# EAGLE schematic boron-v1.00 (EAGLE 9.1.0)
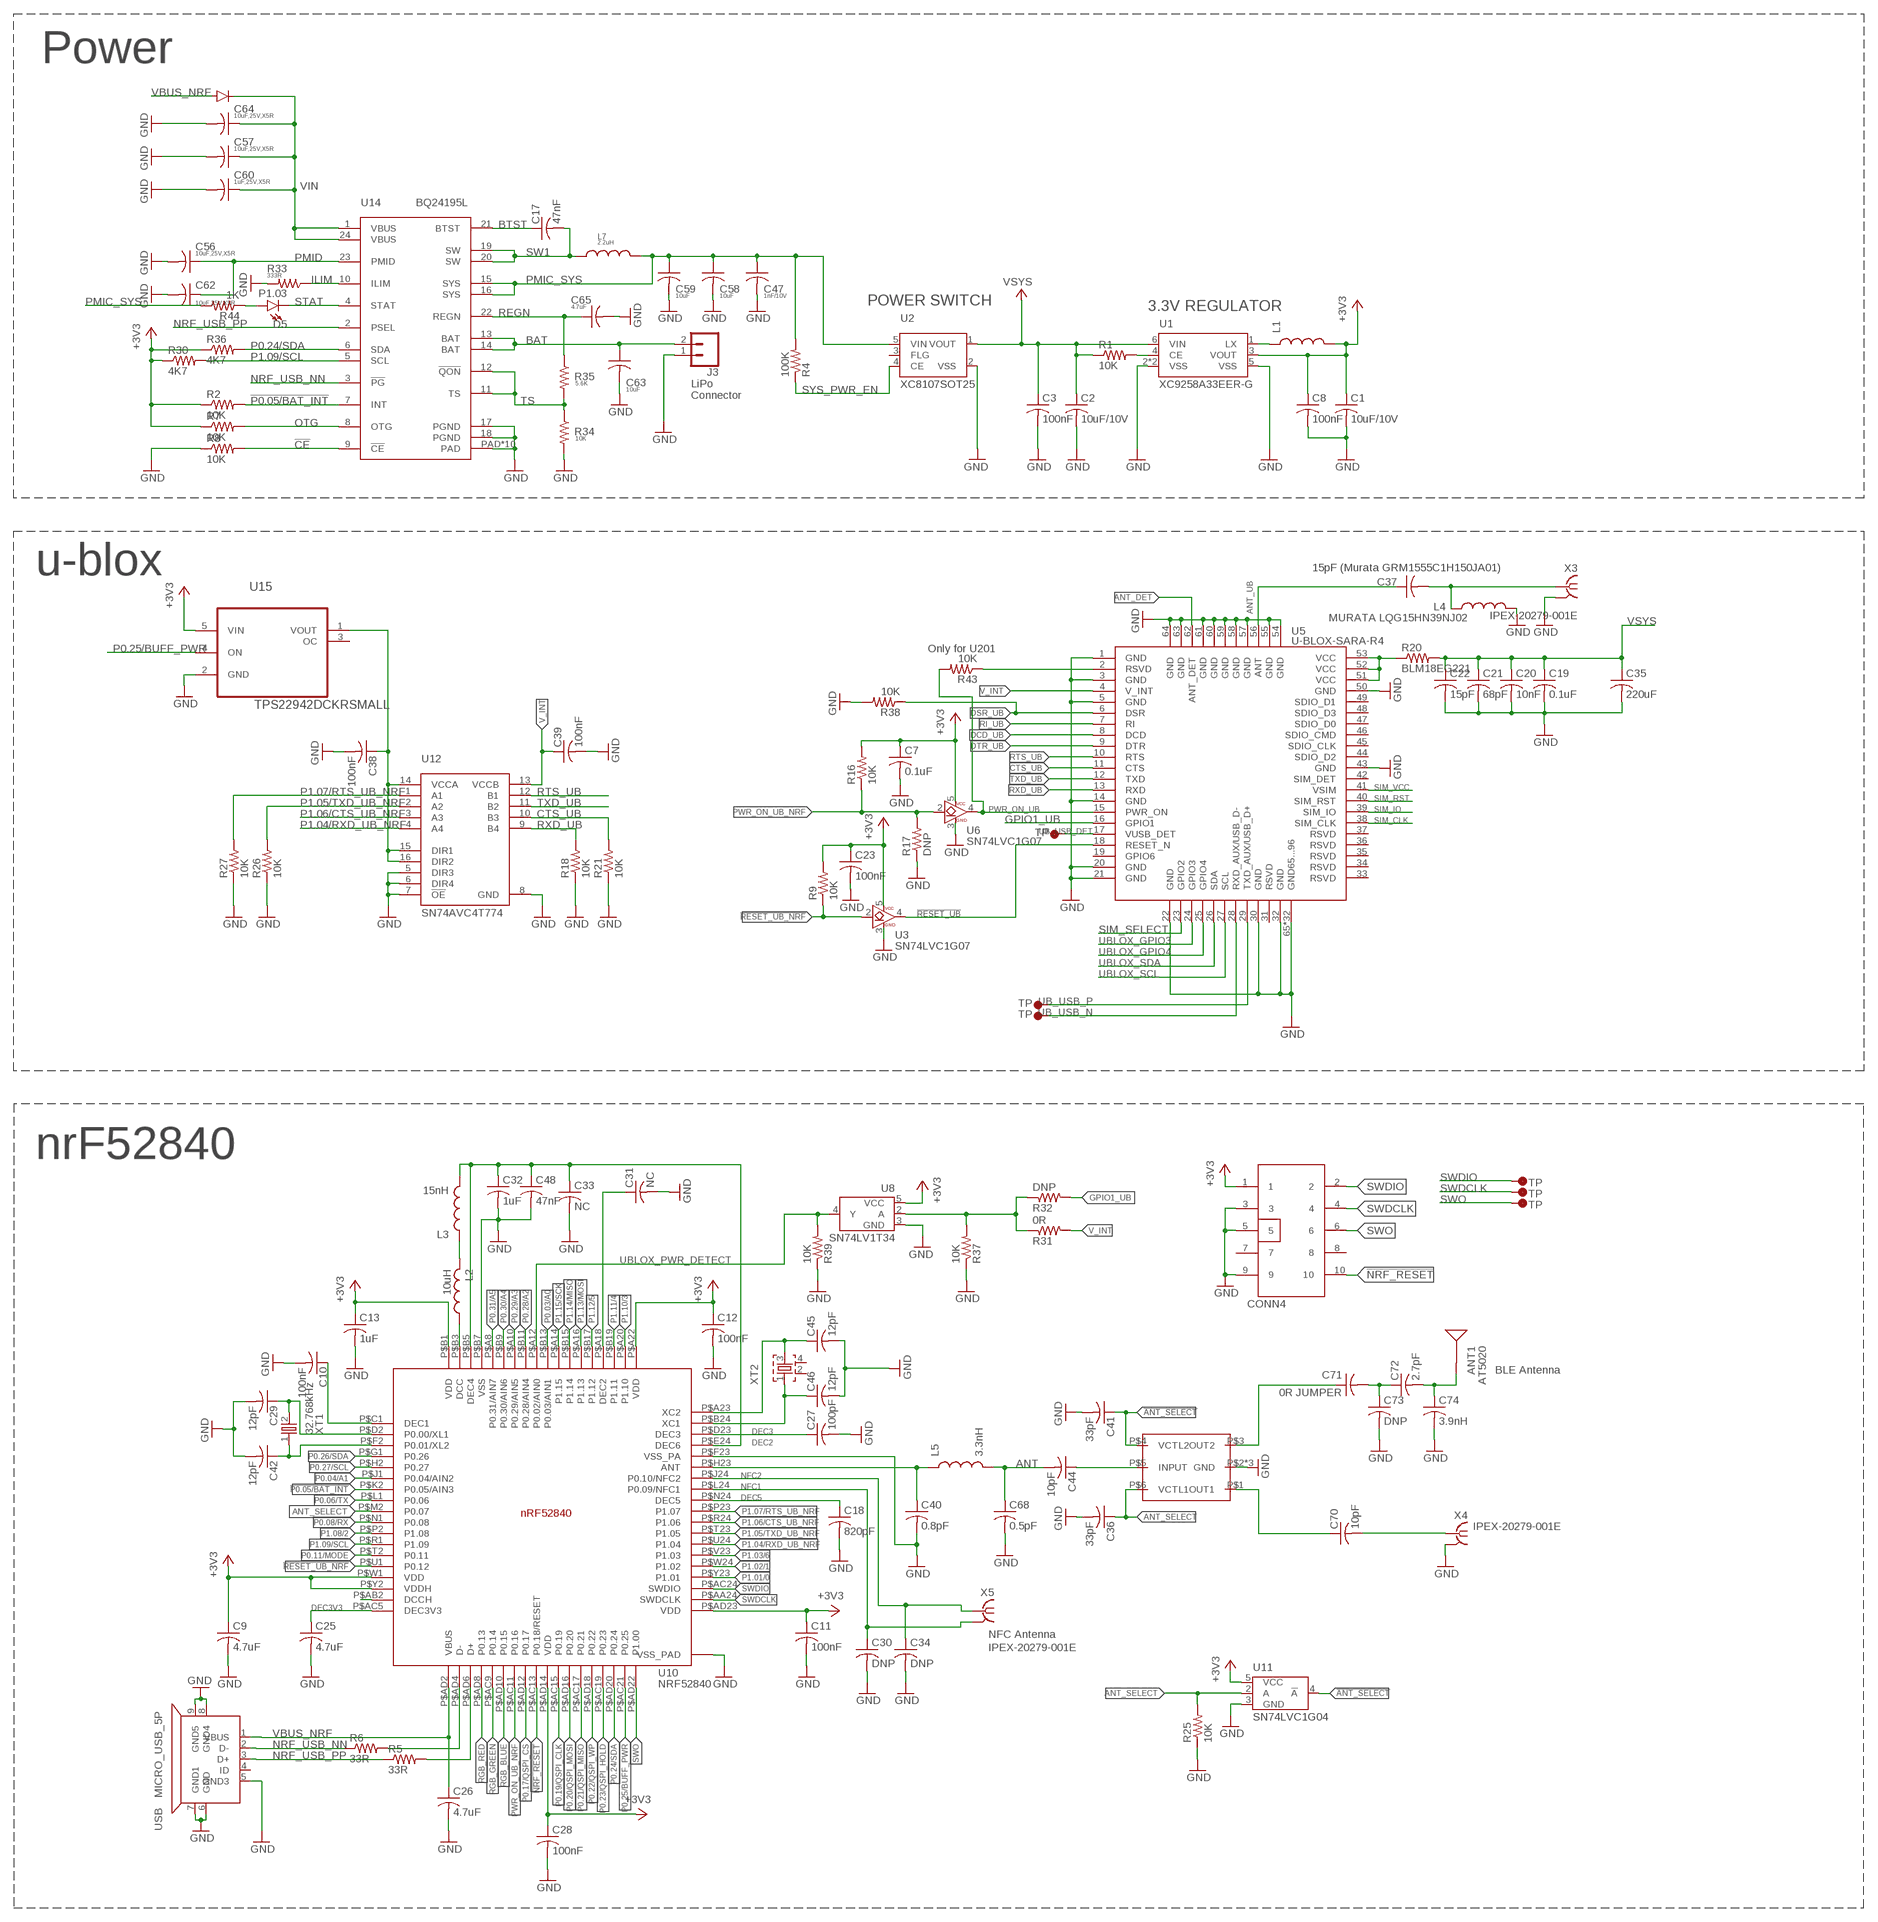
[diagram p0: schematic, sheet 1, part 1 of 2]
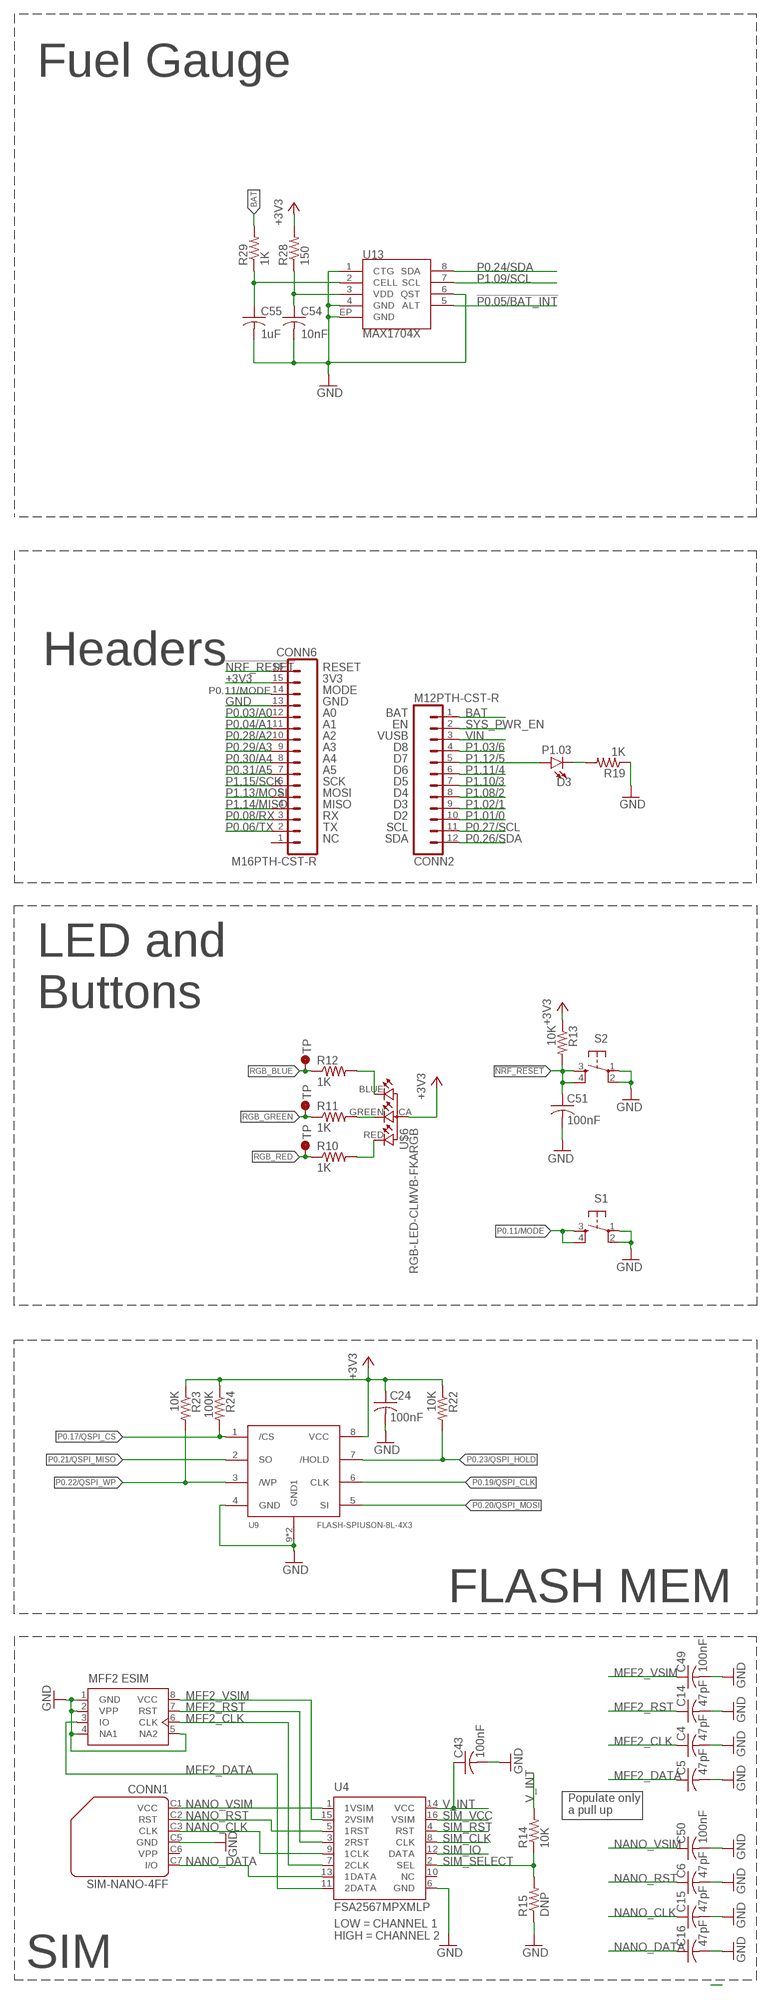
[diagram p1: schematic, sheet 1, part 2 of 2]

## Parts
ANT1  AT5020  [AT5020]
C1  10uF/10V  C-USC0603K  [C0603K]
C2  10uF/10V  C-USC0603K  [C0603K]
C3  100nF  C-USC0603K  [C0603K]
C4  47pF  C-USC0201_B  [C0201_B]
C5  47pF  C-USC0201_B  [C0201_B]
C6  47pF  C-USC0201_B  [C0201_B]
C7  0.1uF  C-US  [C0402_B]
C8  100nF  C-USC0201_B  [C0201_B]
C9  4.7uF  C-USC0402  [C0402]
C10  100nF  C-USC0201_B  [C0201_B]
C11  100nF  C-USC0201_B  [C0201_B]
C12  100nF  C-USC0201_B  [C0201_B]
C13  1uF  C-USC0402  [C0402]
C14  47pF  C-USC0201_B  [C0201_B]
C15  47pF  C-USC0201_B  [C0201_B]
C16  47pF  C-USC0201_B  [C0201_B]
C17  47nF  C-USC0201_B  [C0201_B]
C18  820pF  C-USC0201_B  [C0201_B]
C19  0.1uF  C-US  [C0402_B]
C20  10nF  C-US  [C0402_B]
C21  68pF  C-US  [C0402_B]
C22  15pF  C-US  [C0402_B]
C23  100nF  C-USC0201_B  [C0201_B]
C24  100nF  C-USC0201_B  [C0201_B]
C25  4.7uF  C-USC0402  [C0402]
C26  4.7uF  C-USC0402  [C0402]
C27  100pF  C-USC0201_B  [C0201_B]
C28  100nF  C-USC0201_B  [C0201_B]
C29  12pF  C-USC0201_B  [C0201_B]
C30  DNP  C-USC0201_B  [C0201_B]
C31  NC  C-USC0201_B  [C0201_B]
C32  1uF  C-USC0402K  [C0402K]
C33  NC  C-USC0201_B  [C0201_B]
C34  DNP  C-USC0201_B  [C0201_B]
C35  220uF  C-USC1210  [C1210]
C36  33pF  C-USC0201_B  [C0201_B]
C37  15pF (Murata GRM1555C1H150JA01)  C-US  [C0402_B]
C38  100nF  C-USC0201_B  [C0201_B]
C39  100nF  C-USC0201_B  [C0201_B]
C40  0.8pF  C-USC0201_B  [C0201_B]
C41  33pF  C-USC0201_B  [C0201_B]
C42  12pF  C-USC0201_B  [C0201_B]
C43  100nF  C-USC0201_B  [C0201_B]
C44  10pF  C-USC0201_B  [C0201_B]
C45  12pF  C-USC0201_B  [C0201_B]
C46  12pF  C-USC0201_B  [C0201_B]
C47  1nF/10V  C-US0402  [C0402_B]
C48  47nF  C-USC0201_B  [C0201_B]
C49  100nF  C-USC0201_B  [C0201_B]
C50  100nF  C-USC0201_B  [C0201_B]
C51  100nF  C-USC0201_B  [C0201_B]
C54  10nF  C-US  [C0402_B]
C55  1uF  C-US  [C0402_B]
C56  10uF,25V,X5R  C-US0603  [C0603_B]
C57  10uF,25V,X5R  C-US0603  [C0603_B]
C58  10uF  C-US0603  [C0603_B]
C59  10uF  C-US0603  [C0603_B]
C60  1uF,25V,X5R  C-US0603  [C0603_B]
C62  10uF,25V,X5R  C-US0603  [C0603_B]
C63  10uF  C-US0603  [C0603_B]
C64  10uF,25V,X5R  C-US0603  [C0603_B]
C65  4.7uF  C-US0603  [C0603_B]
C68  0.5pF  C-USC0201_B  [C0201_B]
C70  10pF  C-USC0201_B  [C0201_B]
C71  0R JUMPER  C-USC0201_B  [C0201_B]
C72  2.7pF  C-USC0201_B  [C0201_B]
C73  DNP  C-USC0201_B  [C0201_B]
C74  3.9nH  C-USC0201_B  [C0201_B]
CONN1  SIM-NANO-4FF  [GCT-SIM8100]
CONN2  M12PTH-CST-R  [1X12-CASTELLATED]
CONN4  CONN5X2  [CONN5X2_1.27]
CONN6  M16PTH-CST-R  [1X16-CASTELLATED]
D3  P1.03  LED-RED0603  [LED-0603]
D4  DIODE_NT  [DIODE-DO-220AA_NT(SMP)]
D5  P1.03  LED-RED0603  [LED-0603]
J3  CONN_02-JST-2MM-SMT  [JST-2-SMD@2]
L1  INDUCTOR-SPARKFUNVLS3012ET-4R7M  [INDUCTOR-VLS-E]
L2  10uH  INDUCTOR_0603_L  [RESC0603_L]
L3  15nH  INDUCTOR-0402  [C0402_B]
L4  MURATA LQG15HN39NJ02  INDUCTOR-0402  [C0402_B]
L5  3.3nH  INDUCTOR-0402  [C0402_B]
L7  2.2uH  INDUCTORI  [INDUCTOR-4040]
R1  10K  R-US_R0201_B  [C0201_B]
R2  10K  R-US_R0201_B  [C0201_B]
R4  100K  R-US_R0201_B  [C0201_B]
R5  33R  R-US_R0201_B  [C0201_B]
R6  33R  R-US_R0201_B  [C0201_B]
R7  10K  R-US_R0201_B  [C0201_B]
R8  10K  R-US_R0201_B  [C0201_B]
R9  10K  R-US_R0201_B  [C0201_B]
R10  1K  R-US_R0201_B  [C0201_B]
R11  1K  R-US_R0201_B  [C0201_B]
R12  1K  R-US_R0201_B  [C0201_B]
R13  10K  R-US_R0201_B  [C0201_B]
R14  10K  R-US_R0201_B  [C0201_B]
R15  DNP  R-US_R0201_B  [C0201_B]
R16  10K  R-US_R0201_B  [C0201_B]
R17  DNP  R-US_R0201_B  [C0201_B]
R18  10K  R-US_R0201_B  [C0201_B]
R19  1K  R-US_R0201_B  [C0201_B]
R20  BLM18EG221  R-US_R0603  [R0603]
R21  10K  R-US_R0201_B  [C0201_B]
R22  10K  R-US_R0201_B  [C0201_B]
R23  10K  R-US_R0201_B  [C0201_B]
R24  100K  R-US_R0201_B  [C0201_B]
R25  10K  R-US_R0201_B  [C0201_B]
R26  10K  R-US_R0201_B  [C0201_B]
R27  10K  R-US_R0201_B  [C0201_B]
R28  150  RESISTOR0402-RES  [0402-RES]
R29  1K  RESISTOR0402-RES  [0402-RES]
R30  4K7  R-US_R0201_B  [C0201_B]
R31  0R  R-US_R0201_B  [C0201_B]
R32  DNP  R-US_R0201_B  [C0201_B]
R33  333R  R-US_  [R0402_B]
R34  10K  R-US_  [R0402_B]
R35  5.6K  R-US_  [R0402_B]
R36  4K7  R-US_R0201_B  [C0201_B]
R37  10K  R-US_R0201_B  [C0201_B]
R38  10K  R-US_R0201_B  [C0201_B]
R39  10K  R-US_R0201_B  [C0201_B]
R43  10K  R-US_R0201_B  [C0201_B]
R44  1K  R-US_R0201_B  [C0201_B]
S1  TAC_SWITCHSMD  [TACTILE_SWITCH_SMD]
S2  TAC_SWITCHSMD  [TACTILE_SWITCH_SMD]
U1  XC9258A33EER-G  [USP-6C]
U2  XC8107SOT25  [SOT25]
U3  SN74LVC1G07  [SC-70-5]
U4  FSA2567MPXMLP  [MLP16]
U5  U-BLOX-SARA-R4  [U-BLOX-SARA-U2]
U6  SN74LVC1G07  [SC-70-5]
U7  ESIMSON8  [MFF2]
U8  SN74LV1T34  [SC70-5]
U9  FLASH-SPIUSON-8L-4X3  [USON8-3X4]
U10  NRF52840  [AQFN50P700X700X85_HS-74N]
U11  SN74LVC1G04  [SC70-5]
U12  SN74AVC4T774  [UFQFN-16]
U13  MAX1704X  [TDFN-8]
U14  BQ24195L  BQ24298RTWR  [QFN24]
U15  TPS22942DCKRSMALL  [SC70-5]
U$1  TP5  [TP30_TOP]
U$4  TP5  [TP30_TOP]
U$5  TP5  [TP30_TOP]
U$6  RGB-LED-CLMVB-FKARGB  [PLCC4-2MM-RGB]
U$7  SKY13351-378LF  [MLPD-6-1X1]
U$9  TP5  [TP30_TOP]
U$10  TP5  [TP30_TOP]
U$11  TP5  [TP30_TOP]
U$18  TP5  [TP30_TOP]
U$19  TP5  [TP30_TOP]
U$20  TP5  [TP30_TOP]
USB  MICRO_USB_5P  MICRO_USBMICRO_USB  [MICRO_USB]
X3  IPEX-20279-001E  [IPEX-20279-001E]
X4  IPEX-20279-001E  [IPEX-20279-001E]
X5  IPEX-20279-001E  [IPEX-20279-001E]
XT1  32.768kHz  XTAL_32KHZ  [XTAL_3215_N]
XT2  XTAL_32MHZ  [BT-XTAL_2016_N]

## Nets
!ANT_SELECT: C41.1 U11.4(!A) U$7.P$4(VCTL2)
!CE: R8.2 U14.9(!CE)
!NRF_RESET: C51.1 CONN4.10 CONN6.16 R13.2 S2.3 S2.4 U10.P$AC13(P0.18/RESET)
!P0.05/BAT_INT: R2.2 U10.P$K2(P0.05/AIN3) U13.5(ALT) U14.7(INT)
!RESET_UB: U3.4(B) U5.18(RESET_N)
!RESET_UB_NRF: R9.1 U3.2(A) U10.P$U1(P0.12)
+3V3: C1.1 C7.1 C8.1 C9.1 C11.1 C12.1 C13.1 C23.1 C24.1 C28.1 CONN4.1 CONN6.15 L1.P$2 R2.1 R7.1 R9.2 R13.1 R16.2 R22.1 R23.1 R24.1 R28.2 R30.1 R36.1 U1.3(VOUT) U3.5(VCC) U6.5(VCC) U8.5(VCC) U9.8(VCC) U10.P$A22(VDD) U10.P$AD14(VDD) U10.P$AD23(VDD) U10.P$B1(VDD) U10.P$W1(VDD) U10.P$Y2(VDDH) U11.5(VCC) U15.5(VIN) U$6.CA
ANT [RF]: C44.2 C68.1 L5.2
ANT_DET: U5.62(ANT_DET)
ANT_SELECT: C36.1 R25.2 U10.P$M2(P0.07) U11.2(A) U$7.P$6(VCTL1)
ANT_UB [RF]: C37.1 U5.56(ANT)
BAT [BAT]: C63.1 CONN2.1 J3.2 R29.2 U14.13(BAT) U14.14(BAT)
BTST: C17.1 U14.21(BTST)
CTS_UB: R21.2 U5.11(CTS) U12.10(B3)
DCC: L2.1 U10.P$B3(DCC)
DCD_UB: U5.8(DCD)
DEC2: C32.1 C33.1 C48.1 L3.2 U10.P$B5(DEC4) U10.P$E24(DEC6)
DEC3: C27.1 U10.P$D23(DEC3)
DEC3V3: C25.1 U10.P$AC5(DEC3V3)
DEC5: C18.1 U10.P$N24(DEC5)
DSR_UB: R38.1 U5.6(DSR)
DTR_UB: U5.9(DTR)
GND: C1.2 C2.2 C3.2 C4.2 C5.2 C6.2 C7.2 C8.2 C9.2 C10.2 C11.2 C12.2 C13.2 C14.2 C15.2 C16.2 C18.2 C19.2 C20.2 C21.2 C22.2 C23.2 C24.2 C25.2 C26.2 C27.2 C28.2 C29.2 C30.2 C31.2 C32.2 C33.2 C34.2 C35.2 C36.2 C38.2 C39.2 C40.2 C41.2 C42.2 C43.2 C45.2 C46.2 C47.2 C48.2 C49.2 C50.2 C51.2 C54.2 C55.2 C56.2 C57.2 C58.2 C59.2 C60.2 C62.2 C63.2 C64.2 C65.2 C68.2 C73.2 C74.2 CONN1.C5(GND) CONN4.3 CONN4.5 CONN4.9 CONN6.13 J3.1 L4.2 R8.1 R15.1 R17.1 R18.1 R19.1 R21.1 R25.1 R26.1 R27.1 R33.2 R34.2 R37.1 R38.2 R39.1 S1.1 S1.2 S2.1 S2.2 U1.2(VSS) U1.5(VSS) U1.P$1(VSS) U2.2(VSS) U3.3(GND) U4.6(GND) U5.1(GND) U5.3(GND) U5.5(GND) U5.14(GND) U5.20(GND) U5.21(GND) U5.22(GND) U5.30(GND) U5.32(GND) U5.43(GND) U5.50(GND) U5.54(GND) U5.55(GND) U5.57(GND) U5.58(GND) U5.59(GND) U5.60(GND) U5.61(GND) U5.63(GND) U5.64(GND) U5.65(GND65...96) U5.66(GND65...96) U5.67(GND65...96) U5.68(GND65...96) U5.69(GND65...96) U5.70(GND65...96) U5.71(GND65...96) U5.72(GND65...96) U5.73(GND65...96) U5.74(GND65...96) U5.75(GND65...96) U5.76(GND65...96) U5.77(GND65...96) U5.78(GND65...96) U5.79(GND65...96) U5.80(GND65...96) U5.81(GND65...96) U5.82(GND65...96) U5.83(GND65...96) U5.84(GND65...96) U5.85(GND65...96) U5.86(GND65...96) U5.87(GND65...96) U5.88(GND65...96) U5.89(GND65...96) U5.90(GND65...96) U5.91(GND65...96) U5.92(GND65...96) U5.93(GND65...96) U5.94(GND65...96) U5.95(GND65...96) U5.96(GND65...96) U6.3(GND) U7.1(GND) U7.2(VPP) U7.4(NA1) U7.5(NA2) U8.3(GND) U9.4(GND) U9.9(GND1) U9.10(GND1) U10.P$74(VSS_PAD) U10.P$75(VSS_PAD) U10.P$76(VSS_PAD) U10.P$77(VSS_PAD) U10.P$78(VSS_PAD) U10.P$79(VSS_PAD) U10.P$80(VSS_PAD) U10.P$81(VSS_PAD) U10.P$82(VSS_PAD) U10.P$83(VSS_PAD) U10.P$B7(VSS) U10.P$F23(VSS_PA) U11.3(GND) U12.5(DIR3) U12.6(DIR4) U12.7(!OE) U12.8(GND) U13.1(CTG) U13.4(GND) U13.6(QST) U13.EP(GND) U14.17(PGND) U14.18(PGND) U14.PAD U14.PAD@1(PAD) U14.PAD@2(PAD) U14.PAD@3(PAD) U14.PAD@4(PAD) U14.PAD@5(PAD) U14.PAD@6(PAD) U14.PAD@7(PAD) U14.PAD@8(PAD) U14.PAD@9(PAD) U15.2(GND) U$7.P$2(GND) U$7.P$7(GND) U$7.P$8(GND) USB.5(GND3) USB.6(GND) USB.7(GND1) USB.8(GND4) USB.9(GND5) X3.2@1(GND) X3.2@2(GND) X4.2@1(GND) X4.2@2(GND)
GPIO1_UB: R32.2 U5.16(GPIO1)
ILIM: R33.1 U14.10(ILIM)
MFF2_CLK: C4.1 U4.7(2CLK) U7.6(CLK)
MFF2_DATA: C5.1 U4.11(2DATA) U7.3(IO)
MFF2_RST: C14.1 U4.3(2RST) U7.7(RST)
MFF2_VSIM: C49.1 U4.15(2VSIM) U7.8(VCC)
N$1 [RF]: C37.2 L4.1 X3.1
N$2 [RF]: C44.1 U$7.P$5(INPUT)
N$3: R12.2 U$6.BLUE
N$4: C38.1 U12.14(VCCA) U12.15(DIR1) U12.16(DIR2) U15.1(VOUT)
N$5: R11.2 U$6.GREEN
N$6: R20.1 U5.51(VCC) U5.52(VCC) U5.53(VCC)
N$7: R10.2 U$6.RED
N$8 [RF]: C70.1 U$7.P$1(OUT1)
N$11 [RF]: C40.1 L5.1 U10.P$H23(ANT)
N$14: R31.1 R32.1 R37.2 U8.2(A)
N$16: D5.A R44.1
N$23: R1.2 U1.4(CE)
N$24: D3.C R19.2
N$25: L1.P$1 U1.1(LX)
N$28: C31.1 U10.P$A18(DEC2)
N$29 [RF]: C71.1 U$7.P$3(OUT2)
N$32 [RF]: C70.2 X4.1
N$34 [RF]: C71.2 C72.1 C73.1
N$35: R43.1 U5.2(RSVD)
N$37 [RF]: ANT1.1(SIGNAL) C72.2 C74.1
N$41: C54.1 R28.1 U13.3(VDD)
N$42: C55.1 R29.1 U13.2(CELL)
N$43: C10.1 U10.P$C1(DEC1)
N$59: U10.P$AB2(DCCH)
N$83: L2.2 L3.1
NANO_CLK: C15.1 CONN1.C3(CLK) U4.9(1CLK)
NANO_DATA: C16.1 CONN1.C7(I/O) U4.13(1DATA)
NANO_RST: C6.1 CONN1.C2(RST) U4.5(1RST)
NANO_VSIM: C50.1 CONN1.C1(VCC) U4.1(1VSIM)
NFC1: C30.1 U10.P$L24(P0.09/NFC1) X5.2@1(GND) X5.2@2(GND)
NFC2: C34.1 U10.P$J24(P0.10/NFC2) X5.1
NRF_USB_N: R6.2 U10.P$AD4(D-)
NRF_USB_NN: R6.1 U14.3(!PG) USB.2(D-)
NRF_USB_P: R5.2 U10.P$AD6(D+)
NRF_USB_PP: R5.1 U14.2(PSEL) USB.3(D+)
OTG: R7.2 U14.8(OTG)
P0.03/A0: CONN6.12 U10.P$B13(P0.03/AIN1)
P0.04/A1: CONN6.11 U10.P$J1(P0.04/AIN2)
P0.06/TX: CONN6.2 U10.P$L1(P0.06)
P0.08/RX: CONN6.3 U10.P$N1(P0.08)
P0.11/MODE: CONN6.14 S1.3 S1.4 U10.P$T2(P0.11)
P0.17/QSPI_CS: R24.2 U9.1(/CS) U10.P$AD12(P0.17)
P0.19/QSPI_CLK: U9.6(CLK) U10.P$AC15(P0.19)
P0.20/QSPI_MOSI: U9.5(SI) U10.P$AD16(P0.20)
P0.21/QSPI_MISO: U9.2(SO) U10.P$AC17(P0.21)
P0.22/QSPI_WP: R23.2 U9.3(/WP) U10.P$AD18(P0.22)
P0.23/QSPI_HOLD: R22.2 U9.7(/HOLD) U10.P$AC19(P0.23)
P0.24/SDA: R36.2 U10.P$AD20(P0.24) U13.8(SDA) U14.6(SDA)
P0.25/BUFF_PWR: U10.P$AC21(P0.25) U15.4(ON)
P0.26/SDA: CONN2.12 U10.P$G1(P0.26)
P0.27/SCL: CONN2.11 U10.P$H2(P0.27)
P0.28/A2: CONN6.10 U10.P$B11(P0.28/AIN4)
P0.29/A3: CONN6.9 U10.P$A10(P0.29/AIN5)
P0.30/A4: CONN6.8 U10.P$B9(P0.30/AIN6)
P0.31/A5: CONN6.7 U10.P$A8(P0.31/AIN7)
P1.01/0: CONN2.10 U10.P$Y23(P1.01)
P1.02/1: CONN2.9 U10.P$W24(P1.02)
P1.03/6: CONN2.4 U10.P$V23(P1.03)
P1.04/RXD_UB_NRF: U10.P$U24(P1.04) U12.4(A4)
P1.05/TXD_UB_NRF: R26.2 U10.P$T23(P1.05) U12.2(A2)
P1.06/CTS_UB_NRF: U10.P$R24(P1.06) U12.3(A3)
P1.07/RTS_UB_NRF: R27.2 U10.P$P23(P1.07) U12.1(A1)
P1.08/2: CONN2.8 U10.P$P2(P1.08)
P1.09/SCL: R30.2 U10.P$R1(P1.09) U13.7(SCL) U14.5(SCL)
P1.10/3: CONN2.7 U10.P$A20(P1.10)
P1.11/4: CONN2.6 U10.P$B19(P1.11)
P1.12/5: CONN2.5 D3.A U10.P$B17(P1.12)
P1.13/MOSI: CONN6.5 U10.P$A16(P1.13)
P1.14/MISO: CONN6.4 U10.P$B15(P1.14)
P1.15/SCK: CONN6.6 U10.P$A14(P1.15)
PMIC_SYS: C47.1 C58.1 C59.1 L7.P$2 R4.2 R44.2 U2.5(VIN) U14.15(SYS) U14.16(SYS)
PMID: C56.1 C62.1 U14.23(PMID)
PWR_ON_UB: R43.2 U5.15(PWR_ON) U6.4(B)
PWR_ON_UB_NRF: R16.1 R17.2 U6.2(A) U10.P$AC11(P0.16)
REGN: C65.1 R35.1 U14.22(REGN)
RGB_BLUE: R12.1 U10.P$AD10(P0.15) U$11.P$1(TP)
RGB_GREEN: R11.1 U10.P$AC9(P0.14) U$10.P$1(TP)
RGB_RED: R10.1 U10.P$AD8(P0.13) U$9.P$1(TP)
RI_UB: U5.7(RI)
RTS_UB: U5.10(RTS) U12.12(B1)
RXD_UB: R18.2 U5.13(RXD) U12.9(B4)
SIM_CLK: U4.8(CLK) U5.38(SIM_CLK)
SIM_IO: U4.12(DATA) U5.39(SIM_IO)
SIM_RST: U4.4(RST) U5.40(SIM_RST)
SIM_SELECT: R14.1 R15.2 U4.2(SEL) U5.23(GPIO2)
SIM_VCC: U4.16(VSIM) U5.41(VSIM)
STAT: D5.C U14.4(STAT)
SW1: C17.2 L7.P$1 U14.19(SW) U14.20(SW)
SWDCLK: CONN4.4 U10.P$AA24(SWDCLK) U$4.P$1(TP)
SWDIO: CONN4.2 U10.P$AC24(SWDIO) U$1.P$1(TP)
SWO: CONN4.6 U10.P$AD22(P1.00) U$5.P$1(TP)
SYS_PWR_EN: CONN2.2 R4.1 U2.4(CE)
TS: R34.1 R35.2 U14.11(TS) U14.12(!QON)
TXD_UB: U5.12(TXD) U12.11(B2)
UB_USB_DET: U5.17(VUSB_DET) U$20.P$1(TP)
UB_USB_N: U5.28(RXD_AUX/USB_D-) U$19.P$1(TP)
UB_USB_P: U5.29(TXD_AUX/USB_D+) U$18.P$1(TP)
UBLOX_GPIO3: U5.24(GPIO3)
UBLOX_GPIO4: U5.25(GPIO4)
UBLOX_PWR_DETECT: R39.2 U8.4(Y) U10.P$A12(P0.02/AIN0)
UBLOX_SCL: U5.27(SCL)
UBLOX_SDA: U5.26(SDA)
V_INT: C39.1 C43.1 R14.2 R31.2 U4.14(VCC) U5.4(V_INT) U12.13(VCCB)
VBUS_NRF: C26.1 D4.ANODE U10.P$AD2(VBUS) USB.1(VBUS)
VIN [vcc]: C57.1 C60.1 C64.1 CONN2.3 D4.CATHODE U14.1(VBUS) U14.24(VBUS)
VSYS: C2.1 C3.1 C19.1 C20.1 C21.1 C22.1 C35.1 R1.1 R20.2 U1.6(VIN) U2.1(VOUT)
XC1: C46.1 U10.P$B24(XC1) XT2.1
XC2: C45.1 U10.P$A23(XC2) XT2.3
XL1: C29.1 U10.P$D2(P0.00/XL1) XT1.2
XL2: C42.1 U10.P$F2(P0.01/XL2) XT1.1
Unconnected: CONN1.C6(VPP) CONN4.7 CONN4.8 CONN6.1 U2.3(FLG) U4.10(NC) U5.19(GPIO6) U5.31(RSVD) U5.33(RSVD) U5.34(RSVD) U5.35(RSVD) U5.36(RSVD) U5.37(RSVD) U5.42(SIM_DET) U5.44(SDIO_D2) U5.45(SDIO_CLK) U5.46(SDIO_CMD) U5.47(SDIO_D0) U5.48(SDIO_D3) U5.49(SDIO_D1) U15.3(OC) USB.4(ID) XT2.2 XT2.4

## Notes on the sheet
- Power | Fuel Gauge
- POWER SWITCH
- 3.3V REGULATOR
- LiPo
  Connector
- u-blox
- Headers
- RESET
- Only for U201
- 3V3
- MODE
- GND
- A0 | BAT
- A1 | EN
- A2 | VUSB
- A3 | D8
- A4 | D7
- A5 | D6
- SCK | D5
- MOSI | D4
- MISO | D3
- RX | D2
- TX | SCL
- NC | SDA
- LED and 
  Buttons
- nrF52840
- BLE Antenna
- FLASH MEM
- MFF2 ESIM
- NFC Antenna
- Populate only 
  a pull up
- LOW = CHANNEL 1
  HIGH = CHANNEL 2
- SIM

## Library data of the parts
ANT1 = Particle:AT5020: AT5020 Series 2.4GHz Multilayer Chip Antenna for Wi-Fi, Bluetooth, etc..
C1-C3 C9 C13 C25 C26 C32 C35 = rcl:C-US: CAPACITOR, American symbol
C4-C6 C8 C10-C12 C14-C18 C23 C24 C27-C31 C33 C34 C36 C38-C46 C48-C51 C68 C70-C74 = Particle:C-US: Capacitor
C7 C19-C22 C37 C54 C55 = Spark:C-US: Capacitor
C47 C56-C60 C62-C65 = Bretts-Spark-Library:C-US: Capacitor
CONN1 = Particle:SIM-NANO-4FF: SIM NANO 4FF
CONN2 = Particle:M12: Header 12 Standard 12-pin 0.1" header. Use with straight break away headers (SKU : PRT-00116), right angle break away headers (PRT-00553), swiss pins (PRT-00743), machine pins (PRT-00117), and female headers (PRT-00115).
CONN4 = Particle:CONN5X2: 5x2 pin JTAG connector for Particle mesh dev kits
CONN6 = Particle:M16
D3 D5 = SparkFun-LED:LED-RED: Red SMD LED Used in manufacturing of most products at SparkFun Packages: 0603 - SMD 0603 package [Product Link] <http://docs.avagotech.com/docs/AV02-0551EN> 0603 SMART - SMD 0603 SMART package ( more efficient and expensive)[Product Link] <http://www.osram-os.com/Graphics/XPic2/00077099_0.pdf> 1206 - SMD1206 package [Product Link] <https://www.sparkfun.com/datasheets/DevTools/LilyPad/Q150OVS4.pdff> SparkFun Products: Pro Mini 328 -5V <https://www.sparkfun.com/products/821> RedBoard <https://www.sparkfun.com/products/12757> IOIO-OTG <https://www.sparkfun.com/products/13613>; PROD_ID: DIO-00819; VALUE: RED
D4 = Particle:DIODE
J3 = SparkFun-Connectors:CONN_02: Multi connection point. Often used as Generic Header-pin footprint for 0.1 inch spaced/style header connections On any of the 0.1 inch spaced packages, you can populate with these: Break Away Headers - Straight <https://www.sparkfun.com/products/116> (PRT-00116) Break Away Male Headers - Right Angle <https://www.sparkfun.com/products/553> (PRT-00553) Female Headers <https://www.sparkfun.com/products/115> (PRT-00115) Break Away Headers - Machine Pin <https://www.sparkfun.com/products/117> (PRT-00117) Break Away Female Headers - Swiss Machine Pin <https://www.sparkfun.com/products/743> (PRT-00743) For SCREWTERMINALS and SPRING TERMINALS visit here: Screw Terimnals on SparkFun.com <https://www.sparkfun.com/search/results?term=Screw+Terminals> (5mm/3.5mm/2.54mm spacing) This device is also useful as a general connection point to wire up your design to another part of your project. Our various solder wires solder well into these plated through hole pads. Hook-Up Wire - Assortment (Stranded, 22 AWG) <https://www.sparkfun.com/products/11375> (PRT-11375) Hook-Up Wire - Assortment (Solid Core, 22 AWG) <https://www.sparkfun.com/products/11367> (PRT-11367) View the entire wire category on our website here <https://www.sparkfun.com/categories/141> Special notes: Molex polarized connector foot print use with: PRT-08233 with associated crimp pins and housings. 2.54_SCREWTERM for use with PRT-10571. 3.5mm Screw Terminal footprints for PRT-08084 5mm Screw Terminal footprints for use with PRT-08432; PROD_ID: CONN-11443
L1 = Particle:INDUCTOR-SPARKFUN: Inductors Basic Inductor/Choke - 0603 and 1206. Footprints are not proven and vary greatly between part numbers. SRN6045- 33uH, 20% 1.4A
L2 = Nordic_nRF:INDUCTOR: Generic chip inductor
L3-L5 = Particle:INDUCTOR-0402
L7 = Particle:INDUCTOR
R1 R2 R4-R19 R21-R27 R30-R32 R36-R39 R43 R44 = Particle:R-US_: 0402 Resistor
R20 = rcl:R-US_: RESISTOR, American symbol
R28 R29 = SparkFun-Passives:RESISTOR: Resistor Basic schematic elements and footprints for 0603, 1206, and PTH resistors.
R33-R35 = Spark:R-US_: 0402 Resistor
S1 S2 = Particle:TAC_SWITCH: SMD Tactiile Switch
U1 = Particle:XC9258: 1.0A Synchronous Step-Down DC/DC Converters
U2 = Particle:XC8107
U3 U6 = Particle:SN74LVC1G07
U4 = Particle:FSA2567MPX: Low power dual SIM card analog switch
U5 = Particle:U-BLOX-SARA-R4: ublox SARA-R4 series LTE CATm1/ NB1 modules
U7 = Particle:ESIM
U8 = Particle:SN74LV1T34: Texas Instruments Single Power Supply Single Buffer GATE CMOS Logic Level Shifter
U9 = particle SZ:FLASH-SPI
U10 = Nordic_nRF:NRF52840: nRF52840 Features Advanced Single chip 2.4 GHz multi-protocol SoC 32-bit ARM Cortex-M4F Processor 1.7v to 5.5v operation 1MB flash + 256kB RAM Bluetooth 5 support for long range and high throughput 802.15.4 radio support On-chip NFC PPI –Programmable Peripheral Interconnect Automated power management system with automatic power management of each peripheral Configurable I/O mapping for analog and digital I/O 48 x GPIO 1 x QSPI 4 x Master/Slave SPI 2 x Two-wire interface (I²C) I²S interface 2 x UART 4 x PWM USB 2.0 controller ARM TrustZone CryptoCell-310 Cryptographic and security module AES 128-bit ECB/CCM/AAR hardware accelerator Digital microphone interface (PDM) Quadrature decoder 12-bit ADC Low power comparator On-chip 50Ω balun On-air compatible with nRF52, nRF51 and nRF24 Series Applications Advanced high performance wearables Wearables for secure payments Virtual Reality/Augmented Reality systems Smart Home sensor networks Smart city sensor networks High performance HID controllers Internet of Things (IoT) sensor networks Smart door locks Smart lighting networks Connected white goods
U11 = Particle:SN74LVC1G04: Texas Instruments Single Inverter Gate
U12 = Particle:SN74AVC4T774
U13 = SparkFun-PowerIC:MAX1704X: MAX17043/MAX17044: Battery Fuel Guage (43 is 1cell, 44 is 2cell)
U14 = electron:BQ24298RTWR: Bq24298 I2C Controlled 3A Single Cell USB Charger with Narrow VDC Power Path Management and Adjustable Voltage USB OTG
U15 = Texas Instruments_By_element14_Batch_1:TPS22942DCKR: LOAD SWITCHES
U$1 U$4 U$5 U$9-U$11 U$18-U$20 = Particle:TP: Test Points of all sizes and shapes
U$6 = Particle:RGB-LED-CLMVB-FKA: CREE CLMVB-FKA RGB LED 2mm x 2mm
U$7 = particle SZ:SKY13351-378LF
USB = RedBear:MICRO_USB: Micro-USB
X3 = Spark:IPEX-20279-001E: Ultra Miniature Coaxial SMT RF Receptacle
X4 X5 = Particle:IPEX-20279-001E: Ultra Miniature Coaxial SMT RF Receptacle
XT1 = Nordic_nRF:XTAL_32KHZ
XT2 = Nordic_nRF:XTAL_32MHZ

## Net classes
0 default: width 0.152 mm, clearance 0.152 mm
2 RF: width 0.33 mm, clearance 0.191 mm
3 BAT: clearance 0.203 mm
6 +3V3: width 0.152 mm, clearance 0.152 mm